# EAGLE design LCD shift register Attiny85 (EAGLE 7.7.0)
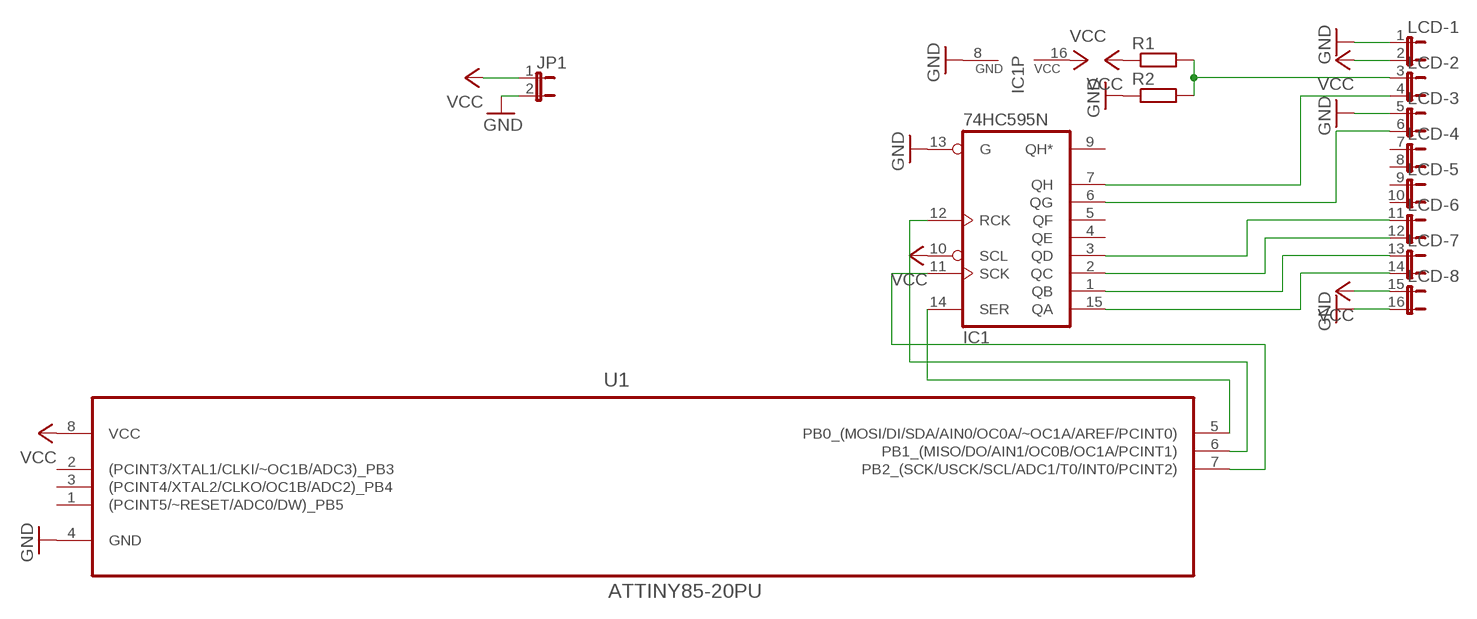
[diagram p0: schematic, sheet 1]

## Parts
IC1  74HC595N  [DIL16]
JP1  JP1E  [JP1]
LCD  JP8QE  [JP8Q]
R1  R-EU_0207/10  [0207/10]
R2  R-EU_0207/10  [0207/10]
U1  ATTINY85-20PU  [DIP254P762X533-8]

## Nets
GND: IC1.8(GND) IC1.13(G) JP1.2 LCD.1 LCD.5 LCD.16 R2.1 U1.4(GND)
N$1: IC1.15(QA) LCD.14
N$2: IC1.1(QB) LCD.13
N$3: IC1.2(QC) LCD.12
N$4: IC1.3(QD) LCD.11
N$5: IC1.6(QG) LCD.6
N$6: IC1.7(QH) LCD.4
N$7: IC1.14(SER) U1.5(PB0_(MOSI/DI/SDA/AIN0/OC0A/~OC1A/AREF/PCINT0))
N$8: IC1.12(RCK) U1.6(PB1_(MISO/DO/AIN1/OC0B/OC1A/PCINT1))
N$9: IC1.11(SCK) U1.7(PB2_(SCK/USCK/SCL/ADC1/T0/INT0/PCINT2))
N$10: LCD.3 R1.2 R2.2
VCC: IC1.10(SCL) IC1.16(VCC) JP1.1 LCD.2 LCD.15 R1.1 U1.8(VCC)
Unconnected: IC1.4(QE) IC1.5(QF) IC1.9(QH*) LCD.7 LCD.8 LCD.9 LCD.10 U1.1((PCINT5/~RESET/ADC0/DW)_PB5) U1.2((PCINT3/XTAL1/CLKI/~OC1B/ADC3)_PB3) U1.3((PCINT4/XTAL2/CLKO/OC1B/ADC2)_PB4)

## Library data of the parts
IC1 = 74xx-eu:74*595: 8-bit SHIFT REGISTER, output latch
JP1 = jumper:JP1E: JUMPER
LCD = jumper:JP8QE: JUMPER
R1 R2 = resistor:R-EU_: RESISTOR, European symbol
U1 = Atmel_By_element14_Batch_1-00:ATTINY85-20PU: 8-bit Microcontroller with In-System Programmable Flash; MPN: ATTINY85-20PU; OC_FARNELL: 1455162; OC_NEWARK: 58M3796; PACKAGE: PDIP-8; SUPPLIER: Atmel

## Net classes
0 default: width 0.203 mm

## Board
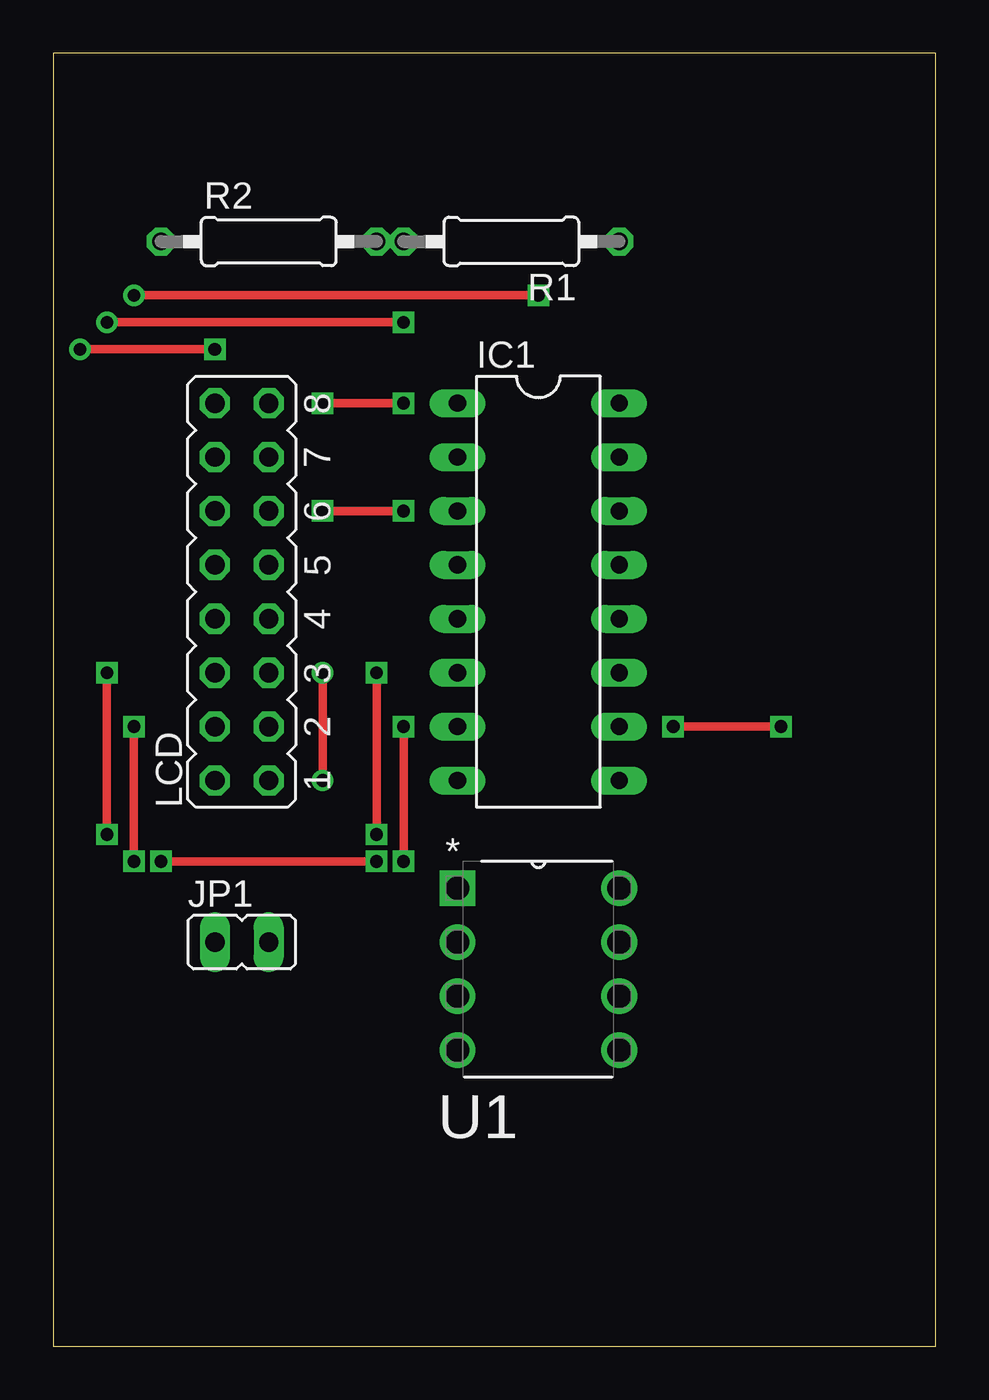
[diagram p1: board, top side]
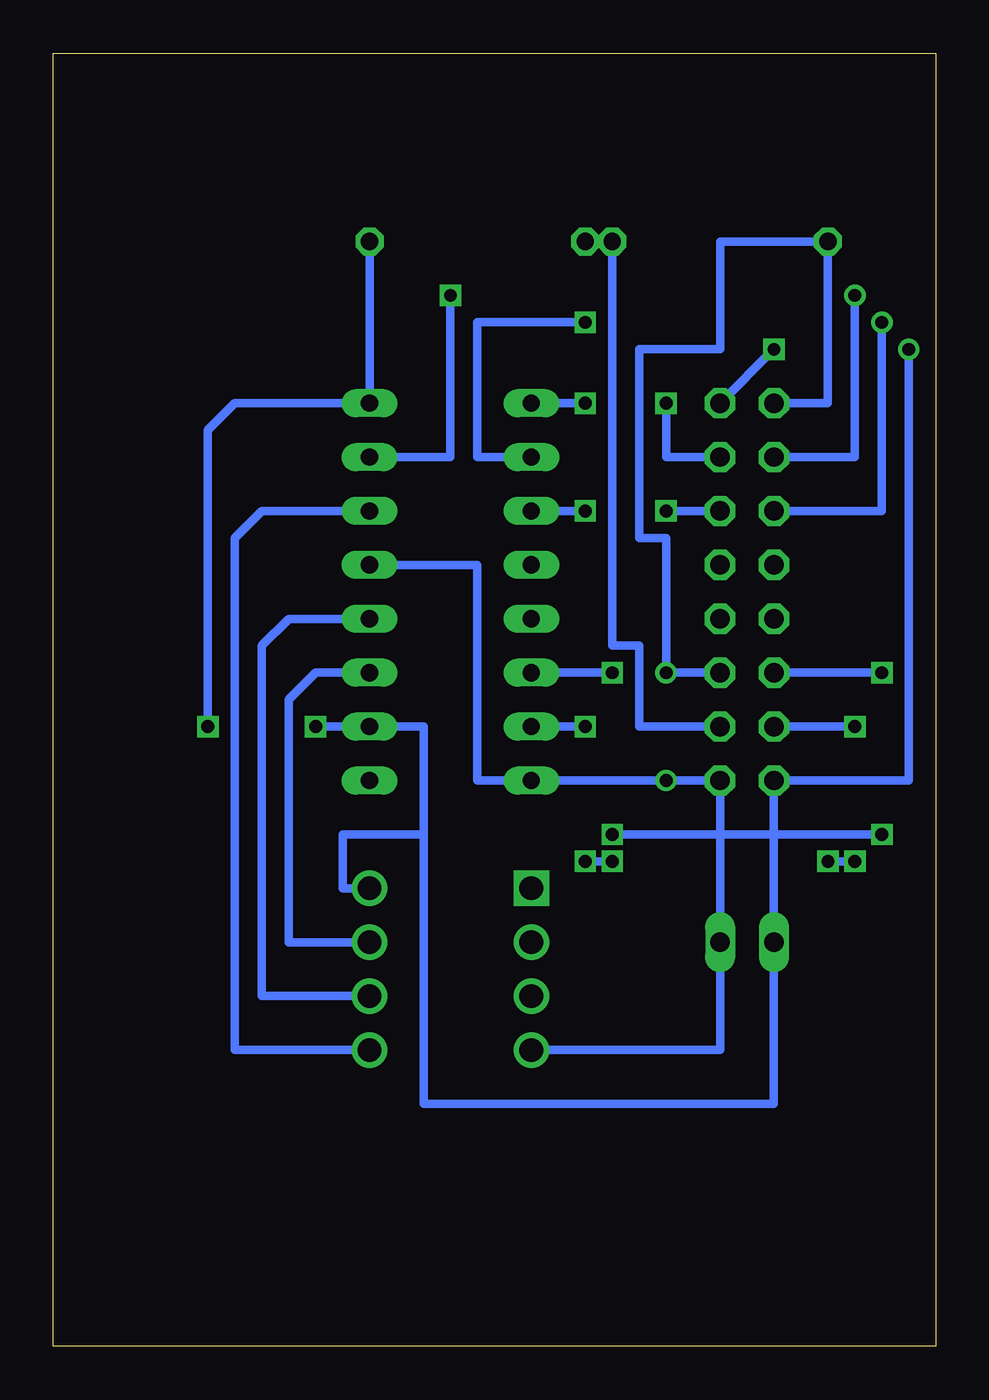
[diagram p2: board, bottom side, seen from below]

Size 41.58 x 60.95 mm. Coordinates in mm from the lower left corner, seen from the top.
Outline: 0,0 41.58,0 41.58,60.95 0,60.95 0,0
Copper layers (1*16): Top 0.035mm / dielectric 1.5mm / Bottom 0.035mm
Design rules "default *": minimum track width 10mil, minimum drill 24mil, track to track 0.79248125mm, track to pad 0.79248125mm, pad to pad 0.79248125mm, via to via 0.79248125mm, smd to smd 0.79248125mm, copper to edge 40mil, drill to drill 8mil, minimum pad ring 10mil, minimum via ring 8mil, stop-mask expansion 4mil, vias tented up to drill 0mil, thermal gap 10mil

### Footprints (pad centres in the part's own frame; a part is rotated, then mirrored left to right if it is on the bottom)
DIL16 = drill 0.813 long: 1 -8.89,-3.81; 2 -6.35,-3.81; 3 -3.81,-3.81; 4 -1.27,-3.81; 5 1.27,-3.81; 6 3.81,-3.81; 7 6.35,-3.81; 8 8.89,-3.81; 9 8.89,3.81; 10 6.35,3.81; 11 3.81,3.81; 12 1.27,3.81; 13 -1.27,3.81; 14 -3.81,3.81; 15 -6.35,3.81; 16 -8.89,3.81
JP1 = drill 0.914 long: 1 0,-1.27; 2 0,1.27
JP8Q = drill 0.914 octagon: 1 -8.89,-1.27; 2 -8.89,1.27; 3 -6.35,-1.27; 4 -6.35,1.27; 5 -3.81,-1.27; 6 -3.81,1.27; 7 -1.27,-1.27; 8 -1.27,1.27; 9 1.27,-1.27; 10 1.27,1.27; 11 3.81,-1.27; 12 3.81,1.27; 13 6.35,-1.27; 14 6.35,1.27; 15 8.89,-1.27; 16 8.89,1.27
0207/10 = drill 0.813 octagon: 1 -5.08,0; 2 5.08,0
DIP254P762X533-8 = drill 1.118 square: 1 -7.62,7.62 | drill 1.118: 2 -7.62,5.08; 3 -7.62,2.54; 4 -7.62,0; 5 0,0; 6 0,2.54; 7 0,5.08; 8 0,7.62

### Placement (x,y rotation side)
IC1  22.86,35.56 270 top
JP1  8.89,19.05 270 top
LCD  8.89,35.56 90 top
R1  21.59,52.07 180 top
R2  10.16,52.07 0 top
U1  26.67,13.97 0 top

### Tracks (layer width: path | path; a pad name or v marks a point on that pad's centre or on a via)
GND  (via drill 0.6 pad 0.25)
  Top 0.406: v12.7,31.75 v12.7,26.67
  Bottom 0.406: LCD.5 v12.7,31.75 12.7,38.1 13.97,38.1 13.97,46.99 10.16,46.99 10.16,52.07 R2.1 5.08,44.45 LCD.16 | IC1.13 21.59,36.83 21.59,26.67 IC1.8 v12.7,26.67 LCD.1 JP1.2 10.16,13.97 U1.4
N$1  (via drill 0.6, 0.6 pad 0.3)
  Top 0.406: v3.81,49.53 v22.86,49.53
  Bottom 0.406: IC1.15 22.86,41.91 v22.86,49.53 | LCD.14 3.81,41.91 v3.81,49.53
N$2  (via drill 0.6)
  Top 0.406: v12.7,44.45 v16.51,44.45
  Bottom 0.406: LCD.13 12.7,41.91 v12.7,44.45 | IC1.1 v16.51,44.45
N$3  (via drill 0.6, 0.6 pad 0.3)
  Top 0.406: v2.54,48.26 v16.51,48.26
  Bottom 0.406: IC1.2 21.59,41.91 21.59,48.26 v16.51,48.26 | LCD.12 2.54,39.37 v2.54,48.26
N$4  (via drill 0.6)
  Top 0.406: v12.7,39.37 v16.51,39.37
  Bottom 0.406: LCD.11 v12.7,39.37 | v16.51,39.37 IC1.3
N$5  (via drill 0.6)
  Top 0.406: v2.54,31.75 v2.54,24.13 | v15.24,24.13 v15.24,31.75
  Bottom 0.406: LCD.6 v2.54,31.75 | v2.54,24.13 v15.24,24.13 | v15.24,31.75 IC1.6
N$6  (via drill 0.6)
  Top 0.406: v16.51,29.21 v16.51,22.86 | v3.81,22.86 v3.81,29.21 | v5.08,22.86 v15.24,22.86
  Bottom 0.406: IC1.7 v16.51,29.21 | LCD.4 v3.81,29.21 | v3.81,22.86 v5.08,22.86 | v16.51,22.86 v15.24,22.86
N$7
  Bottom 0.406: U1.5 33.02,13.97 33.02,38.1 31.75,39.37 IC1.14
N$8
  Bottom 0.406: U1.6 31.75,16.51 31.75,33.02 30.48,34.29 IC1.12
N$9
  Bottom 0.406: U1.7 30.48,19.05 30.48,30.48 29.21,31.75 IC1.11
N$10
  Bottom 0.406: R1.2 R2.2 15.24,33.02 13.97,33.02 13.97,29.21 LCD.3
N$11  (via drill 0.6)
  other vias: 2.54,24.13
N$12  (via drill 0.6)
  other vias: 16.51,29.21
VCC  (via drill 0.6, 0.6 pad 0.3)
  Top 0.406: v1.27,46.99 v7.62,46.99 | v29.21,29.21 v34.29,29.21
  Bottom 0.406: LCD.15 v7.62,46.99 | U1.8 27.94,21.59 27.94,24.13 24.13,24.13 | 24.13,24.13 24.13,11.43 7.62,11.43 JP1.1 LCD.2 1.27,26.67 v1.27,46.99 | 24.13,24.13 24.13,29.21 IC1.10 v29.21,29.21 | R1.1 IC1.16 33.02,44.45 34.29,43.18 v34.29,29.21